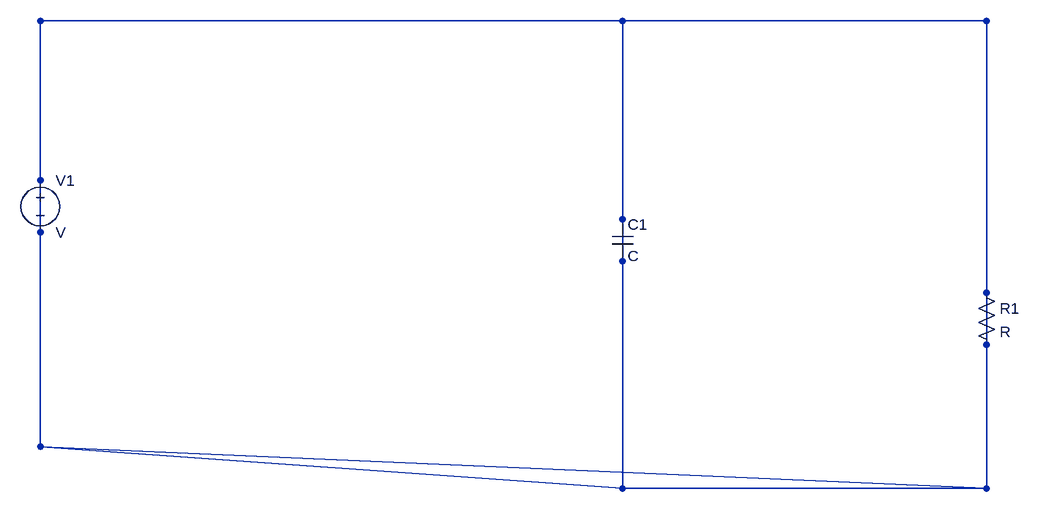
[diagram p0: schematic C11_D1_P3.jpg.asc]
C11_D1_P3.jpg.asc, the LTspice schematic file:
Version 4
SHEET 1 880 680
SYMBOL res 2080 931 R0
SYMATTR InstName R1
SYMBOL voltage 640 758 R0
SYMATTR InstName V1
SYMBOL cap 1520 834 R0
SYMATTR InstName C1
WIRE 1536 1248 2096 1248
WIRE 640 1184 1536 1248
WIRE 1536 528 1536 1248
WIRE 2096 528 2096 1248
WIRE 1536 528 2096 528
WIRE 640 528 2096 528
WIRE 640 1184 2096 1248
WIRE 640 528 640 1184
WIRE 640 528 1536 528

The netlist it stands for:
* C11_D1_P3.jpg.asc
R1 N001 N001 R
V1 N001 N001 V
C1 N001 N001 C
.backanno
.end